# Altium schematic sheet 7419_SUPPLY.SchDoc: 7419 Ckt
size A3; Organization: Altium Limited; Address1: L3, 12a Rodborough Rd; Address2: Frenchs Forest; Address3: NSW; Address4: Australia 2086
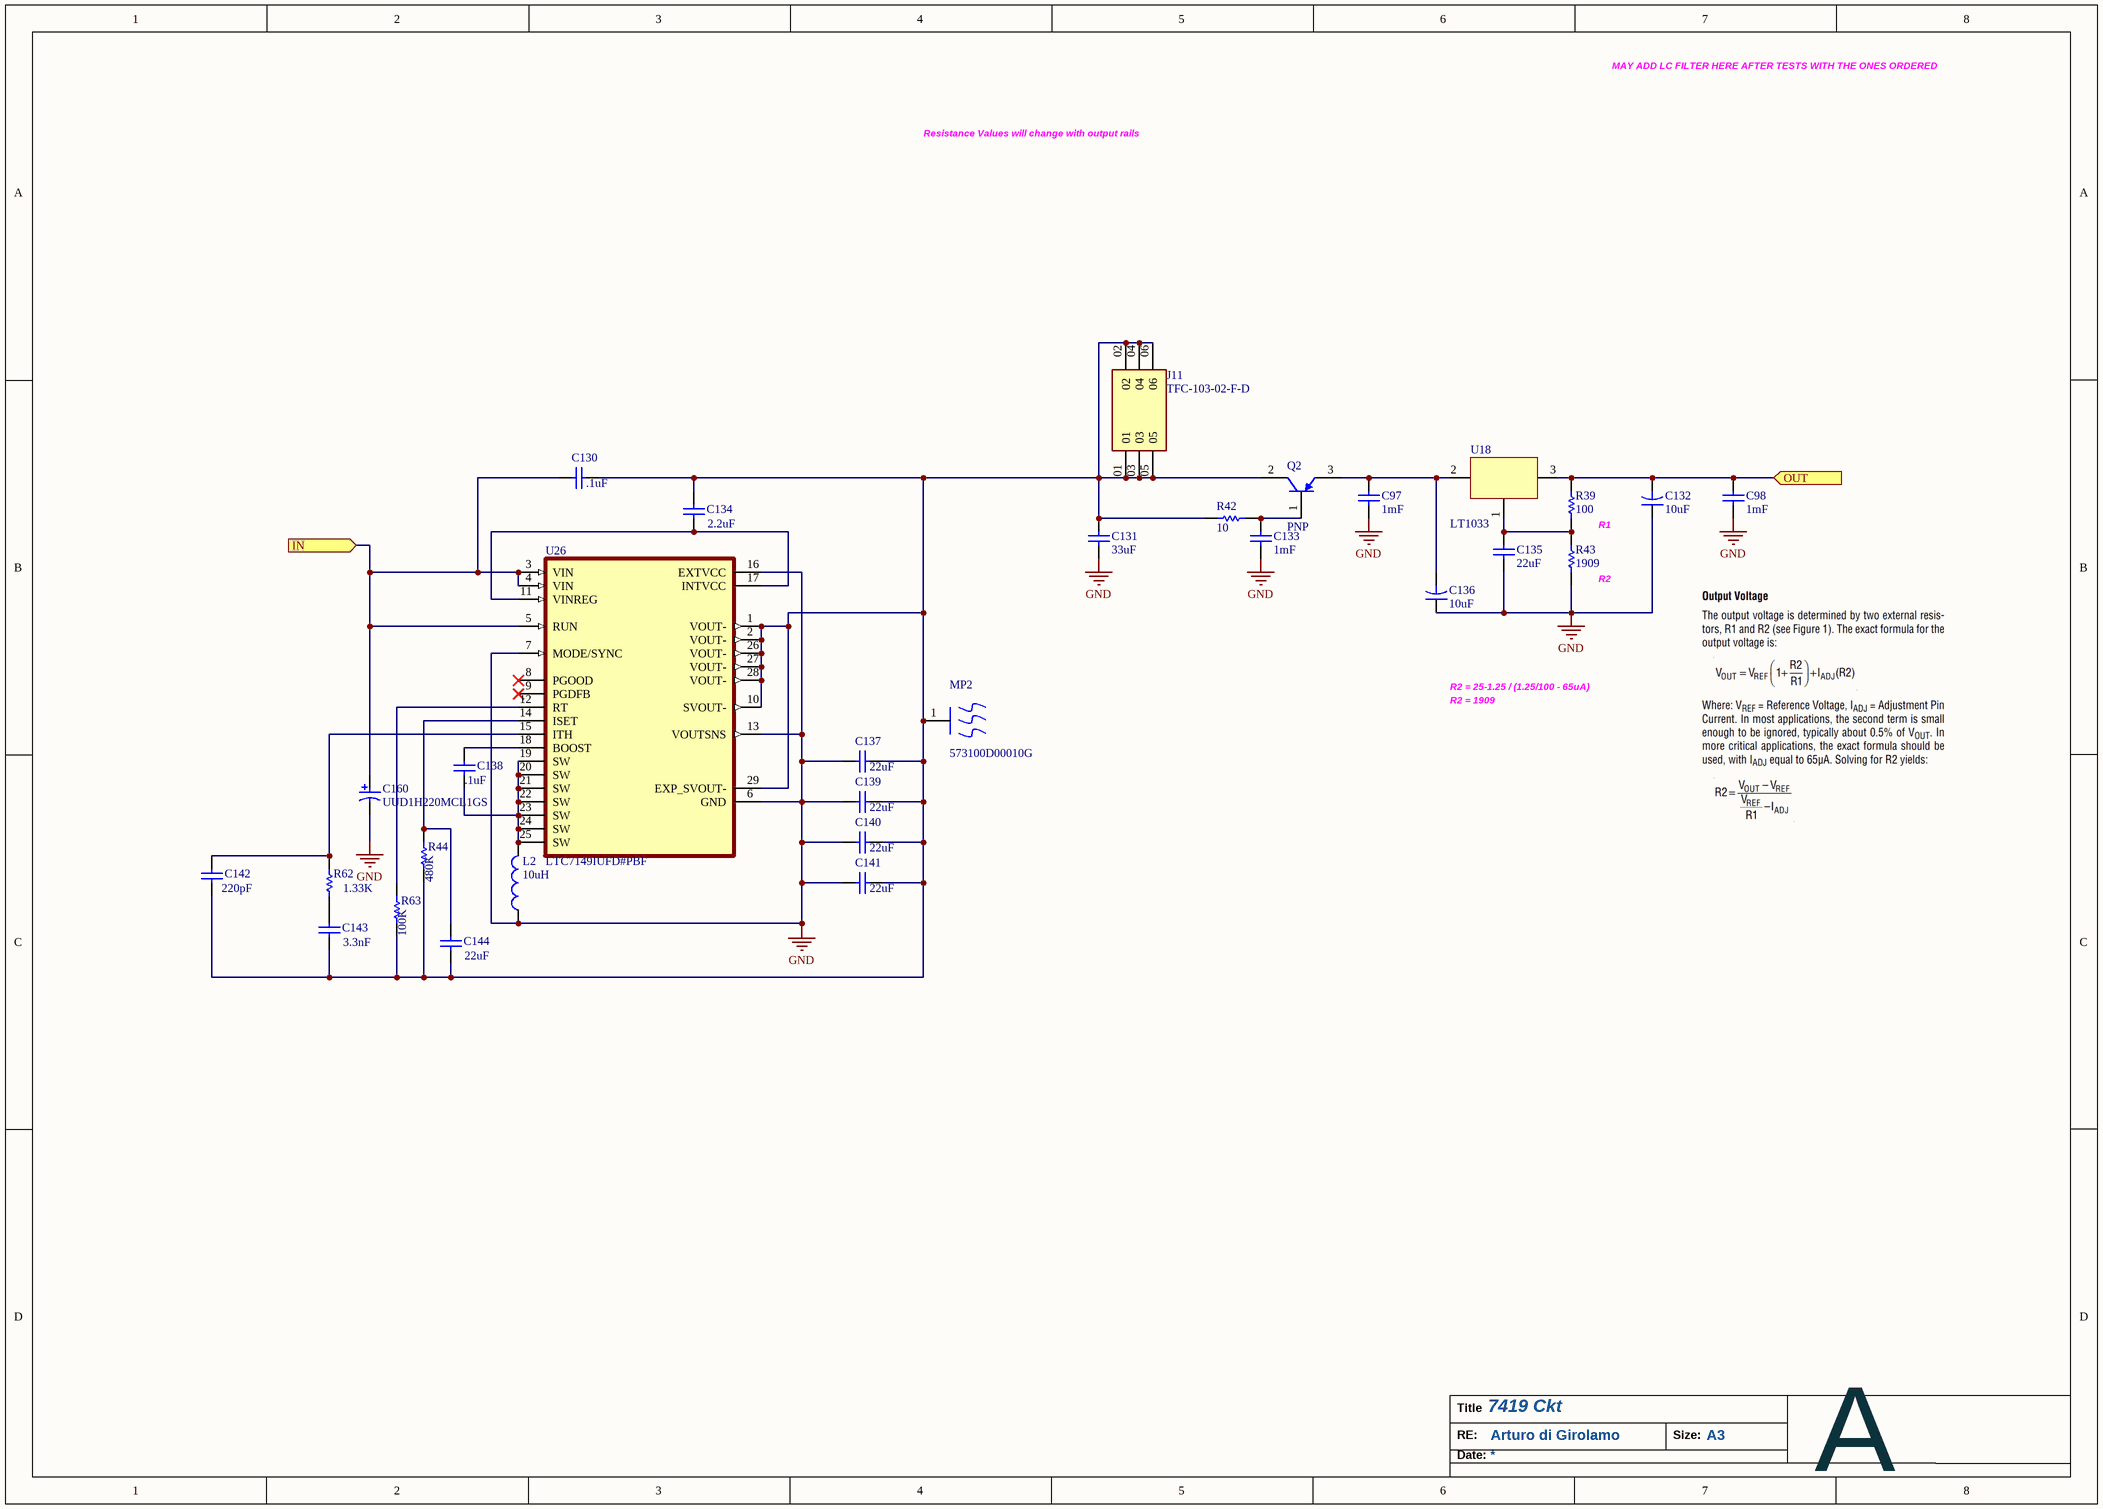
[diagram p0: 7419_SUPPLY.SchDoc]

## Parts
C97  1mF  [EEVFK1V152M]
C98  1mF  [EEVFK1V152M]
C130  value .1uF  [6-0805_M]  (hidden comment: 478-10836-1-ND)
C131  value 33uF  [6-0805_M]  (hidden comment: 490-10749-1-ND)
C132  10uF  [Tantalum_2917]
C133  1mF  [EEVFK1V152M]
C134  value 2.2uF  [6-0805_M]  (hidden comment: 1276-6458-1-ND)
C135  value 22uF  [6-0805_M]  (hidden comment: 490-10749-1-ND)
C136  10uF  [Tantalum_2917]
C137  value 22uF  [6-0805_M]  (hidden comment: 490-10749-1-ND)
C138  value .1uF  [6-0805_M]  (hidden comment: 478-10836-1-ND)
C139  value 22uF  [6-0805_M]  (hidden comment: 490-10749-1-ND)
C140  value 22uF  [6-0805_M]  (hidden comment: 490-10749-1-ND)
C141  value 22uF  [6-0805_M]  (hidden comment: 490-10749-1-ND)
C142  value 220pF  [6-0805_M]  (hidden comment: 399-1151-1-ND)
C143  value 3.3nF  [6-0805_M]  (hidden comment: 399-1153-1-ND)
C144  value 22uF  [6-0805_M]  (hidden comment: 399-7994-1-ND)
C160  UUD1H220MCL1GS  [NIC-CAPA2-6.3X5.8_V]
J11  TFC-103-02-F-D  [SAMTEC_TFC-103-02-F-D]
L2  10uH  [IHLP2020BZER100M01]
MP2  573100D00010G  [FP-573100D00010G-MFG]
Q2  PNP  [TO-220-3]
R39  100  [2512_SMD]
R42  10  [2512_SMD]
R43  1909  [2512_SMD]
R44  value 480K  [6-0805_M]  (hidden comment: 311-360KCRCT-ND)
R62  value 1.33K  [6-0805_M]  (hidden comment: P20607CT-ND)
R63  value 100K  [6-0805_M]  (hidden comment: P100KCCT-ND)
U18  LT1033  [TO-220-3]
U26  LTC7149IUFD#PBF  [QFN50P500X400X80-29N]

## Ports
IN (in), OUT (in)

## Nets
GND: C97.1 C98.1 C131.2 C132.1 C133.1 C135.2 C136.1 C137.2 C139.2 C140.2 C141.2 C160.2 L2.1 R43.1 U26.6(GND) U26.7(MODE/SYNC) U26.13(VOUTSNS) U26.16(EXTVCC)
IN: C130.2 C160.1 U26.3(VIN) U26.4(VIN) U26.5(RUN) ; port IN
OUT: C98.2 C132.2 R39.2 U18.3 ; port OUT
NetC97_2: C97.2 C136.2 Q2.3(E) U18.2
NetC130_1: C130.1 C131.1 C134.2 C137.1 C139.1 C140.1 C141.1 C142.2 C143.2 C144.2 J11.01 J11.02 J11.03 J11.04 J11.05 J11.06 MP2.1 Q2.2(C) R42.1 R44.1 R63.1 U26.1(VOUT-) U26.2(VOUT-) U26.10(SVOUT-) U26.26(VOUT-) U26.27(VOUT-) U26.28(VOUT-) U26.29(EXP_SVOUT-)
NetC133_2: C133.2 Q2.1(B) R42.2
NetC134_1: C134.1 U26.11(VINREG) U26.17(INTVCC)
NetC135_1: C135.1 R39.1 R43.2 U18.1
NetC138_1: C138.1 U26.18(BOOST)
NetC138_2: C138.2 L2.2 U26.19(SW) U26.20(SW) U26.21(SW) U26.22(SW) U26.23(SW) U26.24(SW) U26.25(SW)
NetC142_1: C142.1 R62.2 U26.15(ITH)
NetC143_1: C143.1 R62.1
NetC144_1: C144.1 R44.2 U26.14(ISET)
NetR63_2: R63.2 U26.12(RT)

Not connected (* = marked no-connect by the designer): U26 8(PGOOD)* 9(PGDFB)*

## Notes on the sheet
- MAY ADD LC FILTER HERE AFTER TESTS WITH THE ONES ORDERED
- Resistance Values will change with output rails
- R1
- (near R43) R2
- R2 = 25-1.25 / (1.25/100 - 65uA)
- R2 = 1909
- Title
- Date:
- RE:
- Arturo di Girolamo
- Size:
- A3
- A

## Library data of the parts
C97 C98 C133 = EEV-FK1H102M: Capacitor, 1mF 50V; Value: .01uf; MFGPN: CL21C101JCANNNC; ASYPN: EEVFK1V152M
C130 = Cap: Capacitor; ASYPN: CL21B104KACNNNC; Published: 8-Jun-2000; LatestRevisionDate: 17-Jul-2002; LatestRevisionNote: Re-released for DXP Platform.; PackageReference: RAD-0.3; Publisher: Altium Limited; PackageDescription: Radial Cap, Thru-Hole; 2 Leads; 0.3 in Pin Spacing
C131 C135 C137 C139-C141 C144 = Cap: Capacitor; ASYPN: C2012X5R1V226M125AC; Published: 8-Jun-2000; LatestRevisionDate: 17-Jul-2002; LatestRevisionNote: Re-released for DXP Platform.; PackageReference: RAD-0.3; Publisher: Altium Limited; PackageDescription: Radial Cap, Thru-Hole; 2 Leads; 0.3 in Pin Spacing
C132 C136 = UVR1V102MHD1TO: Capacitor, 100uF NICHICON; ASYPN: T495D106K035ATE260; MFGPN: UVR1V102MHD1TO
C134 = Cap: Capacitor; ASYPN: CL21A225KAFNNNG; Published: 8-Jun-2000; LatestRevisionDate: 17-Jul-2002; LatestRevisionNote: Re-released for DXP Platform.; PackageReference: RAD-0.3; Publisher: Altium Limited; PackageDescription: Radial Cap, Thru-Hole; 2 Leads; 0.3 in Pin Spacing
C138 = Cap: Capacitor; ASYPN: CL21B105KBFNNNG; Published: 8-Jun-2000; LatestRevisionDate: 17-Jul-2002; LatestRevisionNote: Re-released for DXP Platform.; PackageReference: RAD-0.3; Publisher: Altium Limited; PackageDescription: Radial Cap, Thru-Hole; 2 Leads; 0.3 in Pin Spacing
C142 = Cap: Capacitor; ASYPN: 885012207005; Published: 8-Jun-2000; LatestRevisionDate: 17-Jul-2002; LatestRevisionNote: Re-released for DXP Platform.; PackageReference: RAD-0.3; Publisher: Altium Limited; PackageDescription: Radial Cap, Thru-Hole; 2 Leads; 0.3 in Pin Spacing
C143 = Cap: Capacitor; ASYPN: 08055C332KAT2A; Published: 8-Jun-2000; LatestRevisionDate: 17-Jul-2002; LatestRevisionNote: Re-released for DXP Platform.; PackageReference: RAD-0.3; Publisher: Altium Limited; PackageDescription: Radial Cap, Thru-Hole; 2 Leads; 0.3 in Pin Spacing
C160 = CMP-0687-00033-1: Aluminum Electrolytic Capacitor, UD Series, Low Impedance, 22 uF, 50 V, + / - 20%, -55 to 105 degC, Chip Type, 6.3 x 5.8 mm D x L, Pb-Free, Reel; Manufacturer: Nichicon; Impedance: 0.88 Ohm; Rated Ripple Current (at 100kHz): 165 mA; Tolerance Rated Capacitance: -20 to 20%; Rated Capacitance: 22 uF; Endurance Time: 2000 h; Rated Voltage: 50 V; Packing: Dia382mm Reel; PackageReference: CAPAE-D6.3H5.8; ComponentLink3Description: Package Specification; RoHS: TRUE; Diameter: 6.3 mm; ComponentLink1Description: Manufacturer URL; DatasheetVersion: 08/2012; Length: 5.8 mm; ComponentLink2URL: http://products.nichicon.co.jp/en/pdf/XJA043/e-ud.pdf; PartNumber: UUD1H220MCL1GS; Mounting Technology: Surface Mount; ComponentLink2Description: Datasheet; ComponentLink1URL: http://www.nichicon.co.jp/; ComponentLink3URL: http://products.nichicon.co.jp/en/pdf/XJA043/e-ud.pdf; PackageDescription: 2-Pin Surface Mount Device, Diameter 6.3 mm, Height 5.8 mm, Pitch 5.4 mm; ASYPN: UUD1H220MCL1GS
J11 = TFC-103-02-F-D: MF: Samtec; Value: *; Availability: Unavailable; MP: TFC-103-02-F-D; Price: None; Package: None; ASYPN: TFC-103-02-F-D
L2 = IHLP2020BZER100M01: Inductor 10uH VISHAY; MFGPN: IHLP2020BZER100M01; ASYPN: IHLP2020BZER100M01
MP2 = CMP-69313-000002-1: HEATSINK SMT D-PAK/TO-252 TIN; Manufacturer: Aavid Thermalloy; Mating Package: D‐Pak; ComponentLink2URL: https://www.shopaavid.com/images/Product/images/Board%20Level%20Cooling-Surface%20Mount%205731%20v1.pdf; Mouser Description: Heat Sinks SLV HEATSINK TO-252; Octopart: https://octopart.com/573100d00010g-aavid+thermalloy-807578; Category: UNK; Package: 573100D00010G; Manufacturer Part Number: 573100D00010G; ComponentLink2Description: Datasheet; Height: 10.16mm; RoHS: TRUE; Automotive: No; Device Class L1: Electromechanical; Device Class L2: Thermal Management; Lead Free: Yes; Device Class L3: Heat Sinks; Digikey Description: HEATSINK SMT D-PAK/TO-252 TIN
Q2 = PNP: PNP General Purpose Amplifier; Published: 8-Jun-2000; LatestRevisionDate: 15-Jan-2003; LatestRevisionNote: PCB Footprint 'BCY-W3/D4.7' replaced; DatasheetVersion: 1997; PackageVersion: Sep-1998; PackageReference: TO-92A; Publisher: Altium Limited; PackageDescription: TO, Flat Index; 3 In-Line, Axial Leads; Body Dia. 4.5mm; Leads 0.51 x 0.48 mm (max); ComponentLink1Description: Manufacturer Link; ComponentLink1URL: http://www.fairchildsemi.com/; ComponentLink2Description: Datasheet; ComponentLink2URL: http://www.fairchildsemi.com/ds/2N%2F2N3906.pdf
R39 = RR1220P-104-D: 100K 1% 1/10W; Value: 1K; ASYPN: RMCF2512JT100R; MFGPN: RR1220P-104-D
R42 = RNCF0805DTE10R0: 10 ohm 0805; ASYPN: CRCW251210R0FKEG; Value: 10; MFGPN: RNCF0805DTE10R0
R43 = RR1220P-104-D: 100K 1% 1/10W; Value: 1K; ASYPN: ERJ-1TNF1911U; MFGPN: RR1220P-104-D
R44 = Res1: Resistor; ASYPN: RC0805FR-07475KL; Published: 8-Jun-2000; LatestRevisionDate: 17-Jul-2002; LatestRevisionNote: Re-released for DXP Platform.; PackageReference: AXIAL-0.3; Publisher: Altium Limited; PackageDescription: Axial Device, Thru-Hole; 2 Leads; 0.3 in Pin Spacing
R62 = Res1: Resistor; ASYPN: RC0805FR-071K33L; Published: 8-Jun-2000; LatestRevisionDate: 17-Jul-2002; LatestRevisionNote: Re-released for DXP Platform.; PackageReference: AXIAL-0.3; Publisher: Altium Limited; PackageDescription: Axial Device, Thru-Hole; 2 Leads; 0.3 in Pin Spacing
R63 = Res1: Resistor; ASYPN: ERA-6AEB104V; Published: 8-Jun-2000; LatestRevisionDate: 17-Jul-2002; LatestRevisionNote: Re-released for DXP Platform.; PackageReference: AXIAL-0.3; Publisher: Altium Limited; PackageDescription: Axial Device, Thru-Hole; 2 Leads; 0.3 in Pin Spacing
U18 = LT337
U26 = LTC7149IUFD#PBF: Package: None; Price: None; Value: *; MP: LTC7149IUFD#PBF; Availability: Unavailable; ASYPN: LTC7149IUFD#PBF